# EAGLE design lps25h_board (EAGLE 7.2.0)
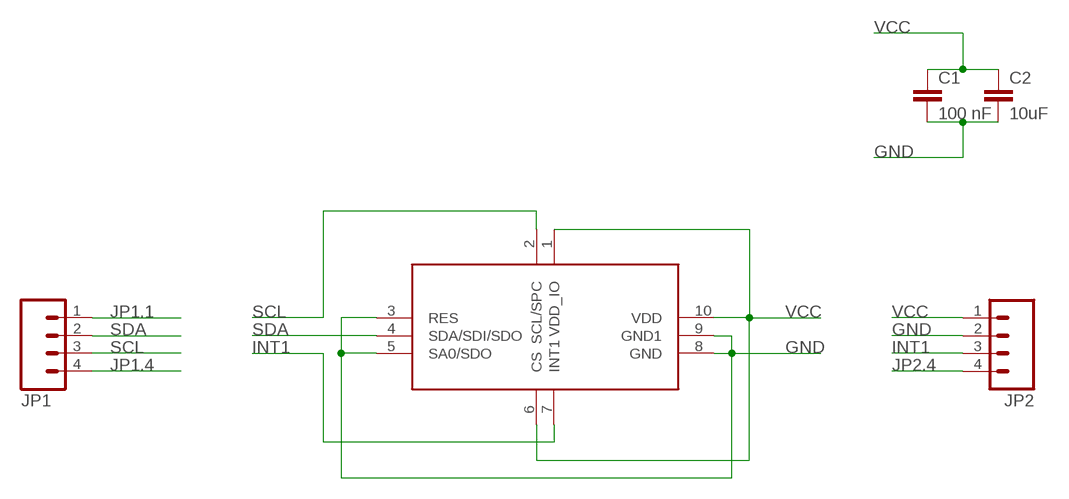
[diagram p0: schematic, sheet 1]

## Parts
C1  100 nF  CAP0805-CAP  [0805-CAP]
C2  10uF  CAP0805-CAP  [0805-CAP]
JP1  M04PTH  [1X04]
JP2  M04PTH  [1X04]
U$1  LPS25HLPS25H  [LPS25H]

## Nets
GND: C1.2 C2.2 JP2.2 U$1.3(RES) U$1.5(SA0/SDO) U$1.8(GND) U$1.9(GND1)
INT1: JP2.3 U$1.7(INT1)
JP1.1: JP1.1
JP1.4: JP1.4
JP2.4: JP2.4
SCL: JP1.3 U$1.2(SCL/SPC)
SDA: JP1.2 U$1.4(SDA/SDI/SDO)
VCC: C1.1 C2.1 JP2.1 U$1.1(VDD_IO) U$1.6(CS) U$1.10(VDD)

## Library data of the parts
C1 C2 = SparkFun-Capacitors:CAP: Capacitor Standard 0603 ceramic capacitor, and 0.1" leaded capacitor.
JP1 JP2 = SparkFun-Connectors:M04: Header 4 Standard 4-pin 0.1" header. Use with straight break away headers (SKU : PRT-00116), right angle break away headers (PRT-00553), swiss pins (PRT-00743), machine pins (PRT-00117), and female headers (PRT-00115). Molex polarized connector foot print use with SKU : PRT-08231 with associated crimp pins and housings. 1MM SMD Version SKU: PRT-10208
U$1 = sensors:LPS25H

## Board
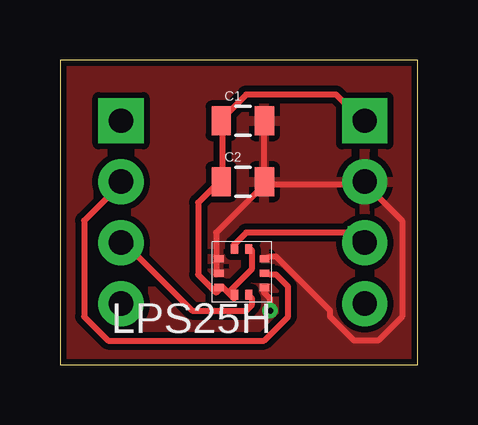
[diagram p1: board, top side]
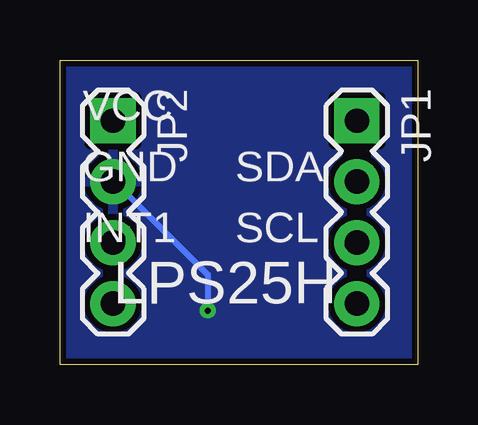
[diagram p2: board, bottom side, seen from below]

Size 14.91 x 12.69 mm. Coordinates in mm from the lower left corner, seen from the top.
Outline: 0,0 14.91,0 14.91,12.69 0,12.69 0,0
Copper layers (1*16): Top 0.035mm / dielectric 1.5mm / Bottom 0.035mm
Design rules "default *": minimum track width 0.25mm, minimum drill 0.25mm, track to track 0.25mm, track to pad 0.25mm, pad to pad 0.25mm, via to via 0.25mm, smd to smd 0.25mm, copper to edge 0.25mm, drill to drill 0.25mm, minimum pad ring 10mil, minimum via ring 8mil, stop-mask expansion 4mil, vias tented up to drill 0mil, thermal gap 10mil

### Footprints (pad centres in the part's own frame; a part is rotated, then mirrored left to right if it is on the bottom)
0805-CAP = smd 0.8 x 1.2: 1 -0.9,0; 2 0.9,0
1X04 = drill 1.016 pad 1.88 square: 1 -3.81,0 | drill 1.016 pad 1.88: 2 -1.27,0; 3 1.27,0; 4 3.81,0
LPS25H = smd 0.3 x 0.4: 1 0.35,0.9; 2 -0.25,0.9; 6 -0.25,-1; 7 0.35,-1 | smd 0.4 x 0.3: 3 -0.9,0.6; 4 -0.9,0; 5 -0.9,-0.6; 8 1,-0.6; 9 1,0; 10 1,0.6

### Placement (x,y rotation side)
C1  7.62,10.16 0 top
C2  7.62,7.62 0 top
JP1  2.54,6.35 270 bottom
JP2  12.7,6.35 270 bottom
U$1  7.62,3.81 180 top

### Tracks (layer width: path | path; a pad name or v marks a point on that pad's centre or on a via)
GND  (via drill 0.25, 0.6)
  Top 0.25: U$1.9 6.5,3.75 6.5,4.25 U$1.8 6.5,4.5 6.5,5.5 8.5,7.5 C2.2 | C1.2 8.5,10 8.5,7.75 C2.2 | v8.75,2.25 8.75,2.75 8.5,3 8.5,3.25 U$1.3 | JP2.2 12.5,7.5 8.75,7.5 C2.2 | v12.75,7.5 14.25,6 14.25,2 13.25,1 12.25,1 11.25,2 11.25,2.25 9,4.5 8.75,4.5 U$1.5
  Bottom 0.25: v8.75,2.25 8.75,3.75 12.5,7.5 JP2.2 v12.75,7.5
  pour Bottom: 0,0 15.24,0 15.24,12.7 0,12.7
  pour Top: -2.54,12.7 15.24,12.7 15.24,0 -2.54,0
INT1  (via drill 0.6)
  Top 0.25: v12.5,5.25 12.25,5.5 7.75,5.5 7.25,5 7.25,4.75 U$1.7
  Bottom 0.25: v12.5,5.25 JP2.3
SCL  (via drill 0.6)
  Top 0.25: v2.75,5 5.5,2.25 7.75,2.25 8,2.5 8,2.75 U$1.2
  Bottom 0.25: v2.75,5 JP1.3
SDA  (via drill 0.6)
  Top 0.25: v2.5,7.5 1,6 1,2 2,1 8.5,1 9.5,2 9.5,3.25 9,3.75 8.75,3.75 U$1.4
  Bottom 0.25: v2.5,7.5 JP1.2
VCC  (via drill 0.6)
  Top 0.25: 7,3 7.25,2.75 U$1.1 | 7,3 6.75,3.25 | 7,3 8,4 8,4.75 U$1.6 | 6.75,3.25 6.5,3 5.75,3.75 5.75,6.75 6.5,7.5 C2.1 6.75,7.75 6.75,10 C1.1 6.75,10.25 7.75,11.25 11.5,11.25 v12.5,10.25 | 6.75,3.25 U$1.10
  Bottom 0.25: v12.5,10.25 JP2.1

### Text on the board
bPlace: VCC | SDA | GND | SCL | INT1 | LPS25H